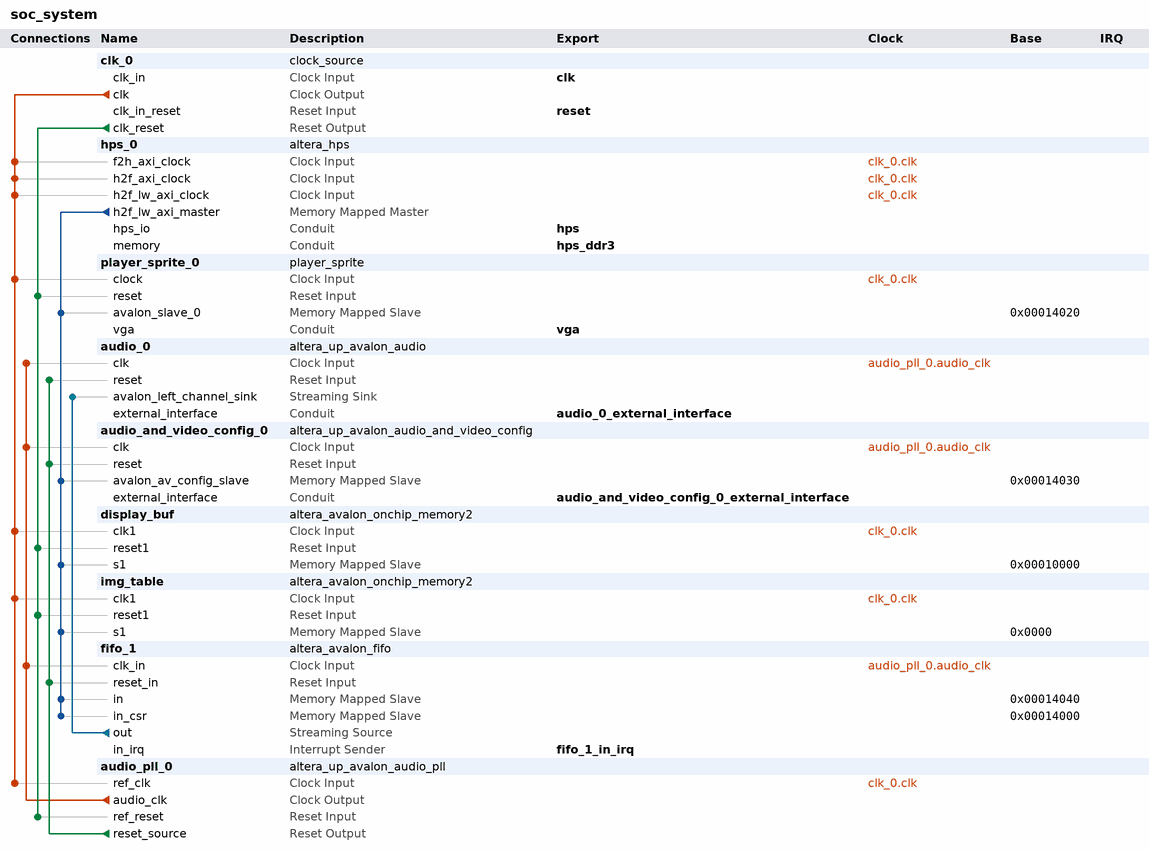
[diagram p0: system contents]
# Platform Designer (Qsys) system soc_system, Cyclone V 5CSEMA5F31C6
# Parameters at their usual value, and those the tool derives, are not listed.
package require -exact qsys 21.1
create_system soc_system
set_project_property DEVICE_FAMILY {Cyclone V}
set_project_property DEVICE 5CSEMA5F31C6

add_instance clk_0 clock_source 21.1
set_instance_parameter_value clk_0 clockFrequency 50000000

add_instance hps_0 altera_hps 21.1
set_instance_parameter_value hps_0 EMAC1_Mode RGMII
set_instance_parameter_value hps_0 EMAC1_PinMuxing {HPS I/O Set 0}
set_instance_parameter_value hps_0 F2SCLK_COLDRST_Enable false
set_instance_parameter_value hps_0 F2SCLK_DBGRST_Enable false
set_instance_parameter_value hps_0 F2SCLK_WARMRST_Enable false
set_instance_parameter_value hps_0 F2SINTERRUPT_Enable false
set_instance_parameter_value hps_0 F2S_Width 2
set_instance_parameter_value hps_0 FPGA_PERIPHERAL_OUTPUT_CLOCK_FREQ_EMAC0_GTX_CLK 125
set_instance_parameter_value hps_0 FPGA_PERIPHERAL_OUTPUT_CLOCK_FREQ_EMAC0_MD_CLK 2.5
set_instance_parameter_value hps_0 FPGA_PERIPHERAL_OUTPUT_CLOCK_FREQ_EMAC1_GTX_CLK 125
set_instance_parameter_value hps_0 FPGA_PERIPHERAL_OUTPUT_CLOCK_FREQ_EMAC1_MD_CLK 2.5
set_instance_parameter_value hps_0 HPS_PROTOCOL DDR3
set_instance_parameter_value hps_0 I2C0_Mode I2C
set_instance_parameter_value hps_0 I2C0_PinMuxing {HPS I/O Set 0}
set_instance_parameter_value hps_0 I2C1_Mode I2C
set_instance_parameter_value hps_0 I2C1_PinMuxing {HPS I/O Set 0}
set_instance_parameter_value hps_0 LWH2F_Enable true
set_instance_parameter_value hps_0 MEM_BANKADDR_WIDTH 3
set_instance_parameter_value hps_0 MEM_CLK_FREQ 400.0
set_instance_parameter_value hps_0 MEM_COL_ADDR_WIDTH 10
set_instance_parameter_value hps_0 MEM_DQ_WIDTH 32
set_instance_parameter_value hps_0 MEM_DRV_STR RZQ/7
set_instance_parameter_value hps_0 MEM_ROW_ADDR_WIDTH 15
set_instance_parameter_value hps_0 MEM_RTT_NOM RZQ/4
set_instance_parameter_value hps_0 MEM_RTT_WR RZQ/4
set_instance_parameter_value hps_0 MEM_TCL 11
set_instance_parameter_value hps_0 MEM_TFAW_NS 30.0
set_instance_parameter_value hps_0 MEM_TRAS_NS 35.0
set_instance_parameter_value hps_0 MEM_TRCD_NS 13.75
set_instance_parameter_value hps_0 MEM_TRFC_NS 260.0
set_instance_parameter_value hps_0 MEM_TRP_NS 13.75
set_instance_parameter_value hps_0 MEM_TRRD_NS 7.7
set_instance_parameter_value hps_0 MEM_VENDOR JEDEC
set_instance_parameter_value hps_0 MEM_WTCL 8
set_instance_parameter_value hps_0 QSPI_Mode N/A
set_instance_parameter_value hps_0 QSPI_PinMuxing Unused
set_instance_parameter_value hps_0 REF_CLK_FREQ 25.0
set_instance_parameter_value hps_0 S2FCLK_USER1CLK_Enable true
set_instance_parameter_value hps_0 S2FCLK_USER2CLK 5
set_instance_parameter_value hps_0 S2F_Width 2
set_instance_parameter_value hps_0 SDIO_Mode {4-bit Data}
set_instance_parameter_value hps_0 SDIO_PinMuxing {HPS I/O Set 0}
set_instance_parameter_value hps_0 SPIM1_Mode {Single Slave Select}
set_instance_parameter_value hps_0 SPIM1_PinMuxing {HPS I/O Set 0}
set_instance_parameter_value hps_0 STM_Enable false
set_instance_parameter_value hps_0 TIMING_BOARD_AC_SKEW 0.03
set_instance_parameter_value hps_0 TIMING_BOARD_AC_TO_CK_SKEW 0.0
set_instance_parameter_value hps_0 TIMING_BOARD_DQ_TO_DQS_SKEW 0.0
set_instance_parameter_value hps_0 TIMING_BOARD_MAX_CK_DELAY 0.03
set_instance_parameter_value hps_0 TIMING_BOARD_MAX_DQS_DELAY 0.02
set_instance_parameter_value hps_0 TIMING_BOARD_SKEW_BETWEEN_DQS 0.08
set_instance_parameter_value hps_0 TIMING_BOARD_SKEW_CKDQS_DIMM_MAX 0.16
set_instance_parameter_value hps_0 TIMING_BOARD_SKEW_CKDQS_DIMM_MIN 0.09
set_instance_parameter_value hps_0 TIMING_BOARD_SKEW_WITHIN_DQS 0.01
set_instance_parameter_value hps_0 TIMING_TDH 65
set_instance_parameter_value hps_0 TIMING_TDQSCK 255
set_instance_parameter_value hps_0 TIMING_TDQSQ 125
set_instance_parameter_value hps_0 TIMING_TDS 30
set_instance_parameter_value hps_0 TIMING_TIH 140
set_instance_parameter_value hps_0 TIMING_TIS 180
set_instance_parameter_value hps_0 TIMING_TQSH 0.4
set_instance_parameter_value hps_0 UART0_Mode {No Flow Control}
set_instance_parameter_value hps_0 UART0_PinMuxing {HPS I/O Set 0}
set_instance_parameter_value hps_0 USB1_Mode SDR
set_instance_parameter_value hps_0 USB1_PinMuxing {HPS I/O Set 0}
set_instance_parameter_value hps_0 desired_cfg_clk_mhz 97.368421
set_instance_parameter_value hps_0 desired_qspi_clk_mhz 400.0

add_instance player_sprite_0 player_sprite 1.0

add_instance audio_0 altera_up_avalon_audio 18.0
set_instance_parameter_value audio_0 audio_in false
set_instance_parameter_value audio_0 avalon_bus_type Streaming
set_instance_parameter_value audio_0 dw 32

add_instance audio_and_video_config_0 altera_up_avalon_audio_and_video_config 18.0
set_instance_parameter_value audio_and_video_config_0 audio_in {Microphone to ADC}
set_instance_parameter_value audio_and_video_config_0 bit_length 24
set_instance_parameter_value audio_and_video_config_0 board DE10-Standard
set_instance_parameter_value audio_and_video_config_0 eai false
set_instance_parameter_value audio_and_video_config_0 line_in_bypass false
set_instance_parameter_value audio_and_video_config_0 sampling_rate {48 kHz}

add_instance display_buf altera_avalon_onchip_memory2 21.1
set_instance_parameter_value display_buf dataWidth 8
set_instance_parameter_value display_buf dualPort true
set_instance_parameter_value display_buf initMemContent false
set_instance_parameter_value display_buf initializationFileName onchip_mem.hex
set_instance_parameter_value display_buf memorySize 512
set_instance_parameter_value display_buf singleClockOperation true

add_instance img_table altera_avalon_onchip_memory2 21.1
set_instance_parameter_value img_table dataWidth 32
set_instance_parameter_value img_table dualPort false
set_instance_parameter_value img_table initMemContent true
set_instance_parameter_value img_table initializationFileName sprites.hex
set_instance_parameter_value img_table memorySize 49152
set_instance_parameter_value img_table useNonDefaultInitFile true
set_instance_parameter_value img_table writable false

add_instance fifo_1 altera_avalon_fifo 21.1
set_instance_parameter_value fifo_1 bitsPerSymbol 8
set_instance_parameter_value fifo_1 channelWidth 0
set_instance_parameter_value fifo_1 errorWidth 0
set_instance_parameter_value fifo_1 fifoDepth 512
set_instance_parameter_value fifo_1 fifoInputInterfaceOptions AVALONMM_WRITE
set_instance_parameter_value fifo_1 fifoOutputInterfaceOptions AVALONST_SOURCE
set_instance_parameter_value fifo_1 singleClockMode true
set_instance_parameter_value fifo_1 symbolsPerBeat 4
set_instance_parameter_value fifo_1 useIRQ true
set_instance_parameter_value fifo_1 usePacket false
set_instance_parameter_value fifo_1 useReadControl false

add_instance audio_pll_0 altera_up_avalon_audio_pll 18.0
set_instance_parameter_value audio_pll_0 gui_refclk 50.0

# connections
add_connection audio_pll_0.audio_clk audio_0.clk clock
add_connection audio_pll_0.audio_clk audio_and_video_config_0.clk clock
add_connection audio_pll_0.audio_clk fifo_1.clk_in clock
add_connection clk_0.clk audio_pll_0.ref_clk clock
add_connection clk_0.clk display_buf.clk1 clock
add_connection clk_0.clk hps_0.f2h_axi_clock clock
add_connection clk_0.clk hps_0.h2f_axi_clock clock
add_connection clk_0.clk hps_0.h2f_lw_axi_clock clock
add_connection clk_0.clk img_table.clk1 clock
add_connection clk_0.clk player_sprite_0.clock clock
add_connection audio_pll_0.reset_source audio_0.reset reset
add_connection audio_pll_0.reset_source audio_and_video_config_0.reset reset
add_connection audio_pll_0.reset_source fifo_1.reset_in reset
add_connection clk_0.clk_reset audio_pll_0.ref_reset reset
add_connection clk_0.clk_reset display_buf.reset1 reset
add_connection clk_0.clk_reset img_table.reset1 reset
add_connection clk_0.clk_reset player_sprite_0.reset reset
add_connection hps_0.h2f_lw_axi_master audio_and_video_config_0.avalon_av_config_slave avalon
set_connection_parameter_value hps_0.h2f_lw_axi_master/audio_and_video_config_0.avalon_av_config_slave baseAddress 0x00014030
add_connection hps_0.h2f_lw_axi_master display_buf.s1 avalon
set_connection_parameter_value hps_0.h2f_lw_axi_master/display_buf.s1 baseAddress 0x00010000
add_connection hps_0.h2f_lw_axi_master fifo_1.in avalon
set_connection_parameter_value hps_0.h2f_lw_axi_master/fifo_1.in baseAddress 0x00014040
add_connection hps_0.h2f_lw_axi_master fifo_1.in_csr avalon
set_connection_parameter_value hps_0.h2f_lw_axi_master/fifo_1.in_csr baseAddress 0x00014000
add_connection hps_0.h2f_lw_axi_master img_table.s1 avalon
set_connection_parameter_value hps_0.h2f_lw_axi_master/img_table.s1 baseAddress 0x0000
add_connection hps_0.h2f_lw_axi_master player_sprite_0.avalon_slave_0 avalon
set_connection_parameter_value hps_0.h2f_lw_axi_master/player_sprite_0.avalon_slave_0 baseAddress 0x00014020
add_connection fifo_1.out audio_0.avalon_left_channel_sink avalon_streaming

# exported interfaces
add_interface audio_0_external_interface conduit end
set_interface_property audio_0_external_interface EXPORT_OF audio_0.external_interface
add_interface audio_and_video_config_0_external_interface conduit end
set_interface_property audio_and_video_config_0_external_interface EXPORT_OF audio_and_video_config_0.external_interface
add_interface clk clock sink
set_interface_property clk EXPORT_OF clk_0.clk_in
add_interface fifo_1_in_irq interrupt sender
set_interface_property fifo_1_in_irq EXPORT_OF fifo_1.in_irq
add_interface hps conduit end
set_interface_property hps EXPORT_OF hps_0.hps_io
add_interface hps_ddr3 conduit end
set_interface_property hps_ddr3 EXPORT_OF hps_0.memory
add_interface reset reset sink
set_interface_property reset EXPORT_OF clk_0.clk_in_reset
add_interface vga conduit end
set_interface_property vga EXPORT_OF player_sprite_0.vga

set_interconnect_requirement {$system} qsys_mm.clockCrossingAdapter HANDSHAKE
set_interconnect_requirement {$system} qsys_mm.enableEccProtection FALSE
set_interconnect_requirement {$system} qsys_mm.insertDefaultSlave FALSE
set_interconnect_requirement {$system} qsys_mm.maxAdditionalLatency 1

save_system soc_system.qsys
